# EAGLE design lm386Amp (EAGLE 7.1.0)
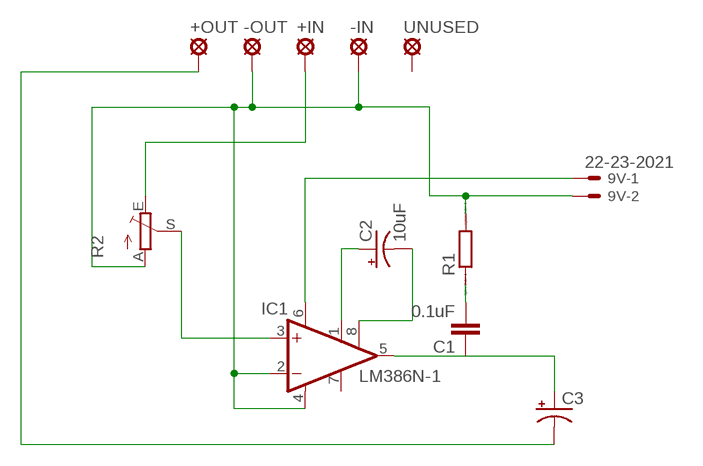
[diagram p0: schematic, sheet 1]

## Parts
9V  22-23-2021  [22-23-2021]
+IN  LSP10  [LSP10]
+OUT  LSP10  [LSP10]
-IN  LSP10  [LSP10]
-OUT  LSP10  [LSP10]
C1  0.1uF  C5/3  [C5B3]
C2  10uF  CPOL-USB45181B  [B45181B]
C3  CAP_POLPTH4  [CPOL-RADIAL-1000UF-25V]
IC1  LM386N-1  [DIL08]
R1  R0204/7  [0204/7]
R2  TRIM_EU-CA14H  [CA14H]
UNUSED  LSP10  [LSP10]

## Nets
GND: 9V.2 -IN.MP -OUT.MP IC1.2(-IN) IC1.4(GND) R1.2 R2.A
N$1: C2.+ IC1.1(GAIN)
N$2: C2.- IC1.8(GAIN)
N$3: 9V.1 IC1.6(VS)
N$4: C1.1 C3.1(+) IC1.5(OUT)
N$6: +IN.MP R2.E
N$7: IC1.3(+IN) R2.S
N$8: C1.2 R1.1
N$9: +OUT.MP C3.2(-)
Unconnected: IC1.7(BYPASS) UNUSED.MP

## Library data of the parts
9V = con-molex:22-23-2021: .100" (2.54mm) Center Header - 2 Pin; MF: MOLEX; MPN: 22-23-2021; OC_FARNELL: 1462926; OC_NEWARK: 25C3832
+IN +OUT -IN -OUT UNUSED = solpad:LSP10: SOLDER PAD drill 1.0 mm, distributor Buerklin, 12H555
C1 = capacitor-wima:C: CAPACITOR naming: grid - package width
C2 = rcl:CPOL-US: POLARIZED CAPACITOR, American symbol
C3 = SparkFun:CAP_POL: Capacitor Polarized These are standard SMD and PTH capacitors. Normally 10uF, 47uF, and 100uF in electrolytic and tantalum varieties. Always verify the external diameter of the through hole cap, it varies with capacity, voltage, and manufacturer. The EIA devices should be standard.
IC1 = linear:LM386?-*: Low Voltage Audio Power Amplifier Source: http://cache.national.com/ds/LM/LM386.pdf
R1 = eagle-ltspice:R: RESISTOR, European symbol; SPICEMODEL: NONE; SPICEPREFIX: R
R2 = pot:TRIM_EU-: POTENTIOMETER

## Board
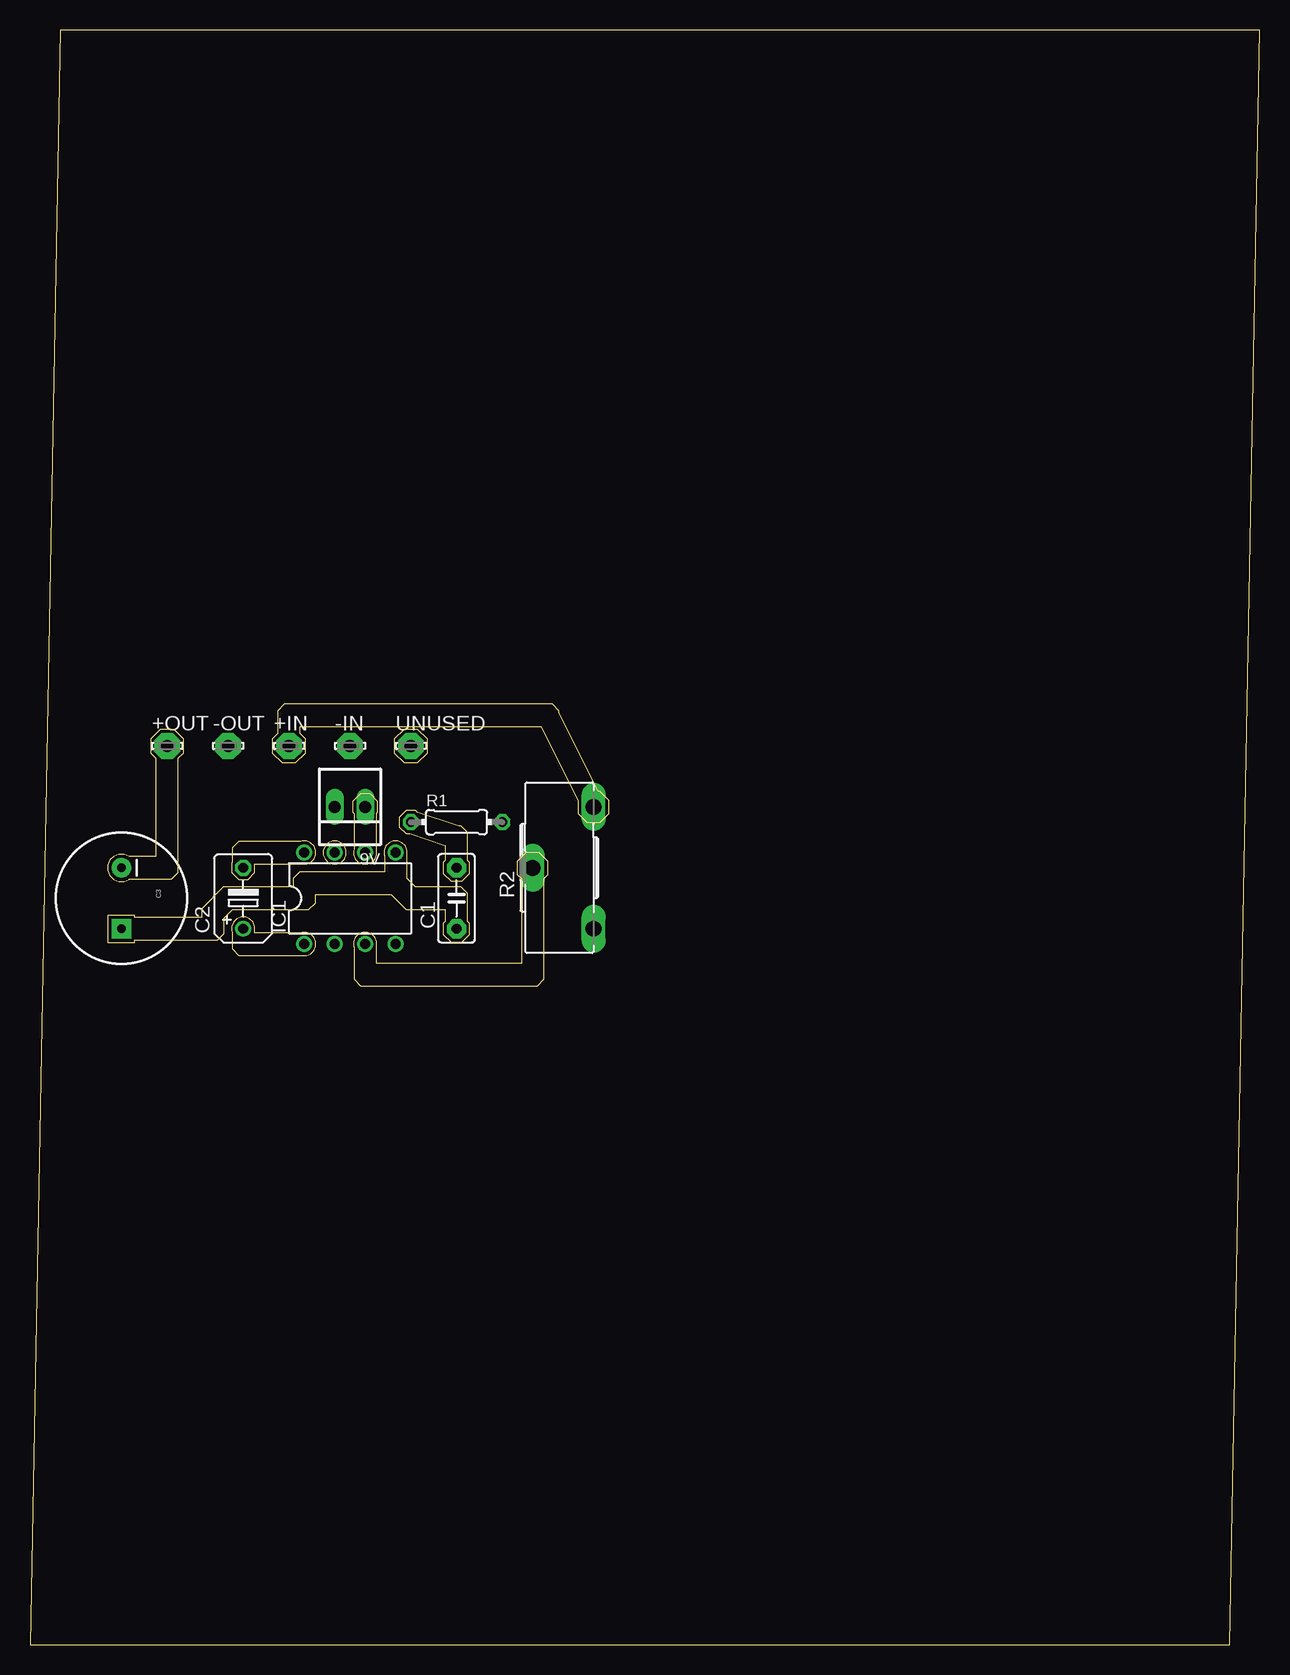
[diagram p1: board, top side]
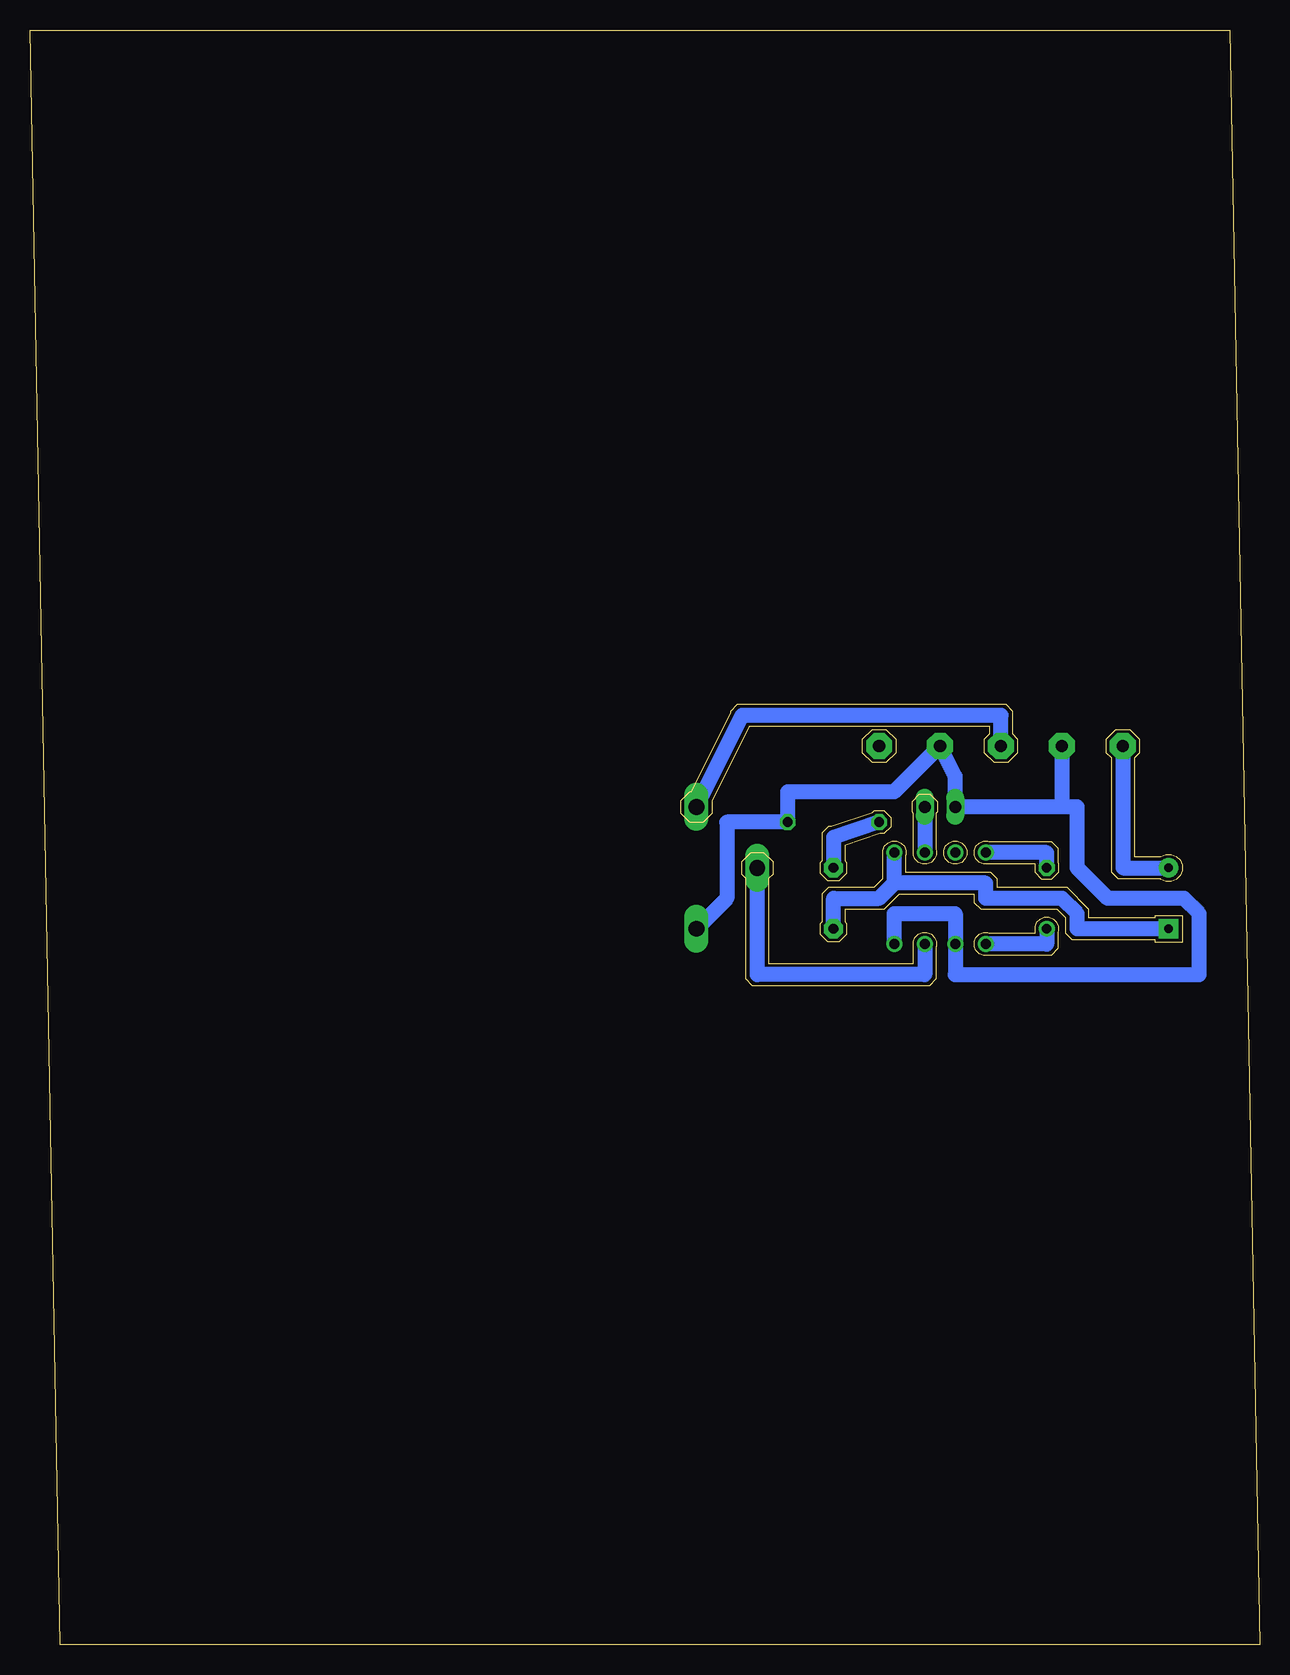
[diagram p2: board, bottom side, seen from below]

Size 102.54 x 134.61 mm. Coordinates in mm from the lower left corner, seen from the top.
Outline: 0,0 100,0 102.54,134.61 2.54,134.61 0,0
Copper layers (1*16): Top 0.035mm / dielectric 1.5mm / Bottom 0.035mm
Design rules "default": minimum track width 10mil, minimum drill 24mil, track to track 8mil, track to pad 8mil, pad to pad 8mil, via to via 8mil, smd to smd 8mil, copper to edge 40mil, drill to drill 8mil, minimum pad ring 10mil, minimum via ring 8mil, stop-mask expansion 4mil, vias tented up to drill 0mil, thermal gap 10mil
Milling: 232 lines

### Footprints (pad centres in the part's own frame; a part is rotated, then mirrored left to right if it is on the bottom)
22-23-2021 = drill 1 long: 1 -1.27,0; 2 1.27,0
LSP10 = drill 1.016 pad 2.159 octagon: MP 0,0
C5B3 = drill 0.813 pad 1.6 octagon: 1 -2.54,0; 2 2.54,0
B45181B = drill 0.813: + -2.54,0 | drill 0.813 octagon: - 2.54,0
CPOL-RADIAL-1000UF-25V = drill 0.7 pad 1.651 square: 1 2.54,0 | drill 0.7 pad 1.651: 2 -2.54,0
DIL08 = drill 0.813 pad 1.27: 1 -3.81,-3.81; 2 -1.27,-3.81; 3 1.27,-3.81; 4 3.81,-3.81; 5 3.81,3.81; 6 1.27,3.81; 7 -1.27,3.81; 8 -3.81,3.81
0204/7 = drill 0.813 octagon: 1 -3.81,0; 2 3.81,0
CA14H = drill 1.321 long: A -5.08,0; E 5.08,0; S 0,5.08

### Placement (x,y rotation side)
9V  26.67,69.85 180 top
+IN  21.59,74.93 0 top
+OUT  11.43,74.93 0 top
-IN  26.67,74.93 0 top
-OUT  16.51,74.93 0 top
C1  35.56,62.23 90 top
C2  17.78,62.23 90 top
C3  7.62,62.23 270 top
IC1  26.67,62.23 0 top
R1  35.56,68.58 0 top
R2  46.99,64.77 90 top
UNUSED  31.75,74.93 0 top

### Tracks (layer width: path | path; a pad name or v marks a point on that pad's centre or on a via)
GND
  Bottom 1.27: IC1.4 30.48,60.96 25.4,60.96 IC1.2 25.4,55.88 5.08,55.88 5.08,60.96 6.35,62.23 12.7,62.23 15.24,64.77 15.24,69.85 16.51,69.85 | -OUT.MP 16.51,69.85 | 16.51,69.85 9V.2 25.4,72.39 -IN.MP 30.48,71.12 39.37,71.12 R1.2 44.45,68.58 44.45,62.23 R2.A
N$1
  Bottom 1.27: C2.+ 17.78,58.42 IC1.1
N$2
  Bottom 1.27: C2.- 17.78,66.04 IC1.8
N$3
  Bottom 1.27: 9V.1 IC1.6
N$4
  Bottom 1.27: 30.48,63.5 22.86,63.5 22.86,62.23 16.51,62.23 15.24,60.96 15.24,59.69 C3.1 | 30.48,63.5 IC1.5 | C1.1 35.56,62.23 31.75,62.23 30.48,63.5
N$6
  Bottom 1.27: +IN.MP 21.59,77.47 43.18,77.47 R2.E
N$7
  Bottom 1.27: IC1.3 27.94,55.88 41.91,55.88 R2.S
N$8
  Bottom 1.27: R1.1 35.56,67.31 C1.2
N$9
  Bottom 1.27: +OUT.MP 11.43,64.77 C3.2